# EAGLE design IRIO3 (EAGLE 9.2.2)
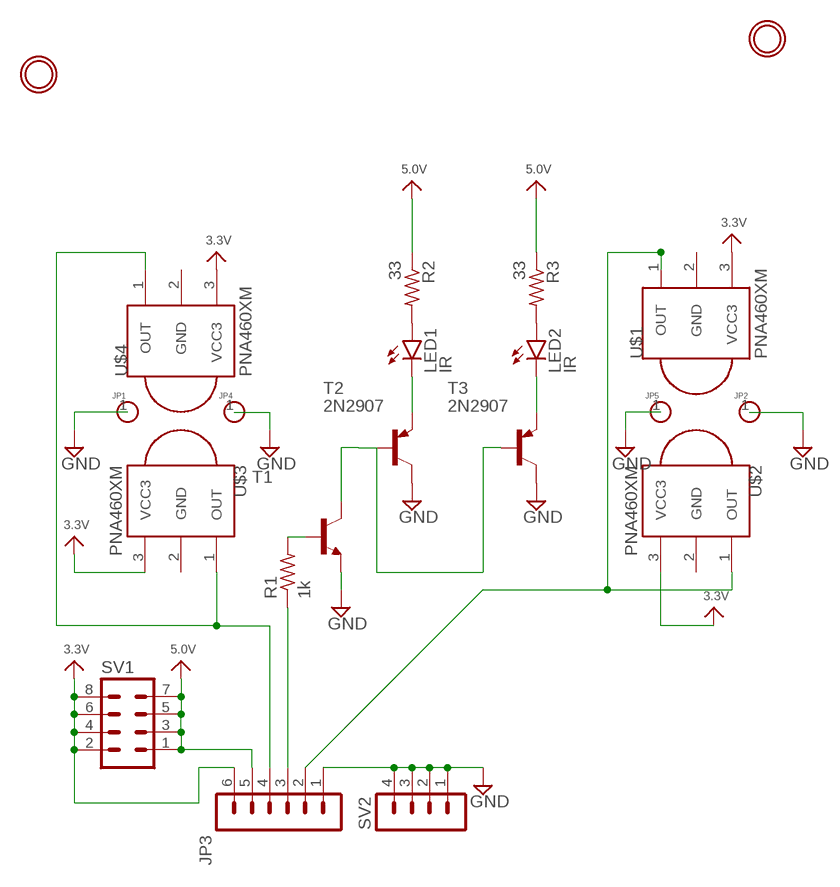
[diagram p0: schematic, sheet 1]

## Parts
JP1  HOLE-DEV  [HOLE-PAH]
JP2  HOLE-DEV  [HOLE-PAH]
JP3  MA06-1  [MA06-1]
JP4  HOLE-DEV  [HOLE-PAH]
JP5  HOLE-DEV  [HOLE-PAH]
LED1  IR  LED3MM  [LED3MM]
LED2  IR  LED3MM  [LED3MM]
R1  1k  R-US_0207/10  [0207/10]
R2  33  R-US_0204/2V  [0204V]
R3  33  R-US_0204/2V  [0204V]
SV1  MA04-2  [MA04-2]
SV2  MA04-1  [MA04-1]
T1  -NPN-TO92-EBC  [TO92-EBC]
T2  2N2907  MPSA56-TO92  [TO92-CBE]
T3  2N2907  MPSA56-TO92  [TO92-CBE]
U$1  PNA460XM  [PNA460XM]
U$2  PNA460XM  [PNA460XM]
U$3  PNA460XM  [PNA460XM]
U$4  PNA460XM  [PNA460XM]
U$7  MOUNTINGHOLE2.0  [MOUNTINGHOLE_2.0_PLATED]
U$8  MOUNTINGHOLE2.0  [MOUNTINGHOLE_2.0_PLATED]

## Nets
GND: JP1.1 JP2.1 JP3.1 JP4.1 JP5.1 SV2.1 SV2.2 SV2.3 SV2.4 T1.E T2.C T3.C
N$1: JP3.3 R1.1
N$2: JP3.4 U$3.1(OUT) U$4.1(OUT)
N$4: R1.2 T1.B
N$5: LED2.K(C) T3.E
N$6: JP3.2 U$1.1(OUT) U$2.1(OUT)
N$7: LED1.K(C) T2.E
N$8: T1.C T2.B T3.B
N$10: LED2.A R3.2
N$11: LED1.A R2.2
VCC3: JP3.6 SV1.2 SV1.4 SV1.6 SV1.8 U$1.3(VCC3) U$2.3(VCC3) U$3.3(VCC3) U$4.3(VCC3) ; supply symbol labelled 3.3V
VCC5: JP3.5 R2.1 R3.1 SV1.1 SV1.3 SV1.5 SV1.7 ; supply symbol labelled 5.0V

## Power pins joined to a net without a drawn wire
GND: U$1.2(GND) U$2.2(GND) U$3.2(GND) U$4.2(GND)

## Library data of the parts
JP1 JP2 JP4 JP5 = cyborg5:HOLE-DEV: HOLE A hole that you can solder something into.
JP3 = con-lstb:MA06-1: PIN HEADER; OC_FARNELL: unknown; OC_NEWARK: unknown
LED1 LED2 = led:LED: LED OSRAM: - CHIPLED LG R971, LG N971, LY N971, LG Q971, LY Q971, LO R971, LY R971 LH N974, LH R974 LS Q976, LO Q976, LY Q976 LO Q996 - Hyper CHIPLED LW Q18S LB Q993, LB Q99A, LB R99A - SideLED LS A670, LO A670, LY A670, LG A670, LP A670 LB A673, LV A673, LT A673, LW A673 LH A674 LY A675 LS A676, LA A676, LO A676, LY A676, LW A676 LS A679, LY A679, LG A679 - Hyper Micro SIDELED® LS Y876, LA Y876, LO Y876, LY Y876 LT Y87S - SmartLED LW L88C, LW L88S LB L89C, LB L89S, LG L890 LS L89K, LO L89K, LY L89K LS L896, LA L896, LO L896, LY L896 - TOPLED LS T670, LO T670, LY T670, LG T670, LP T670 LSG T670, LSP T670, LSY T670, LOP T670, LYG T670 LG T671, LOG T671, LSG T671 LB T673, LV T673, LT T673, LW T673 LH T674 LS T676, LA T676, LO T676, LY T676, LB T676, LH T676, LSB T676, LW T676 LB T67C, LV T67C, LT T67C, LS T67K, LO T67K, LY T67K, LW E67C LS E67B, LA E67B, LO E67B, LY E67B, LB E67C, LV E67C, LT E67C LW T67C LS T679, LY T679, LG T679 LS T770, LO T770, LY T770, LG T770, LP T770 LB T773, LV T773, LT T773, LW T773 LH T774 LS E675, LA E675, LY E675, LS T675 LS T776, LA T776, LO T776, LY T776, LB T776 LHGB T686 LT T68C, LB T68C - Hyper Mini TOPLED® LB M676 - Mini TOPLED Santana® LG M470 LS M47K, LO M47K, LY M47K Source: http://www.osram.convergy.de LUXEON: - LUMILED® LXK2-PW12-R00, LXK2-PW12-S00, LXK2-PW14-U00, LXK2-PW14-V00 LXK2-PM12-R00, LXK2-PM12-S00, LXK2-PM14-U00 LXK2-PE12-Q00, LXK2-PE12-R00, LXK2-PE12-S00, LXK2-PE14-T00, LXK2-PE14-U00 LXK2-PB12-K00, LXK2-PB12-L00, LXK2-PB12-M00, LXK2-PB14-N00, LXK2-PB14-P00, LXK2-PB14-Q00 LXK2-PR12-L00, LXK2-PR12-M00, LXK2-PR14-Q00, LXK2-PR14-R00 LXK2-PD12-Q00, LXK2-PD12-R00, LXK2-PD12-S00 LXK2-PH12-R00, LXK2-PH12-S00 LXK2-PL12-P00, LXK2-PL12-Q00, LXK2-PL12-R00 Source: www.luxeon.com KINGBRIGHT: KA-3528ASYC Source: www.kingbright.com
R1-R3 = resistor:R-US_: RESISTOR, American symbol
SV1 = con-lstb:MA04-2: PIN HEADER; OC_FARNELL: unknown; OC_NEWARK: unknown
SV2 = con-lstb:MA04-1: PIN HEADER; OC_FARNELL: unknown; OC_NEWARK: unknown
T1 = transistor:*-NPN-: NPN Transistror BF959 corrected 2008.03.06
T2 T3 = transistor-pnp:*-?: PNP Transistor
U$1-U$4 = adafruit:PNA460XM: IR 38KHz receiver PNA4602 and related receivers http://www.ladyada.net/library/pcb/eaglelibrary.html
U$7 U$8 = microbuilder:MOUNTINGHOLE: Mounting Hole For #2 screws (0.086"/2.18mm width, 0.094"/2.4mm hole) use 2.5mm

## Board
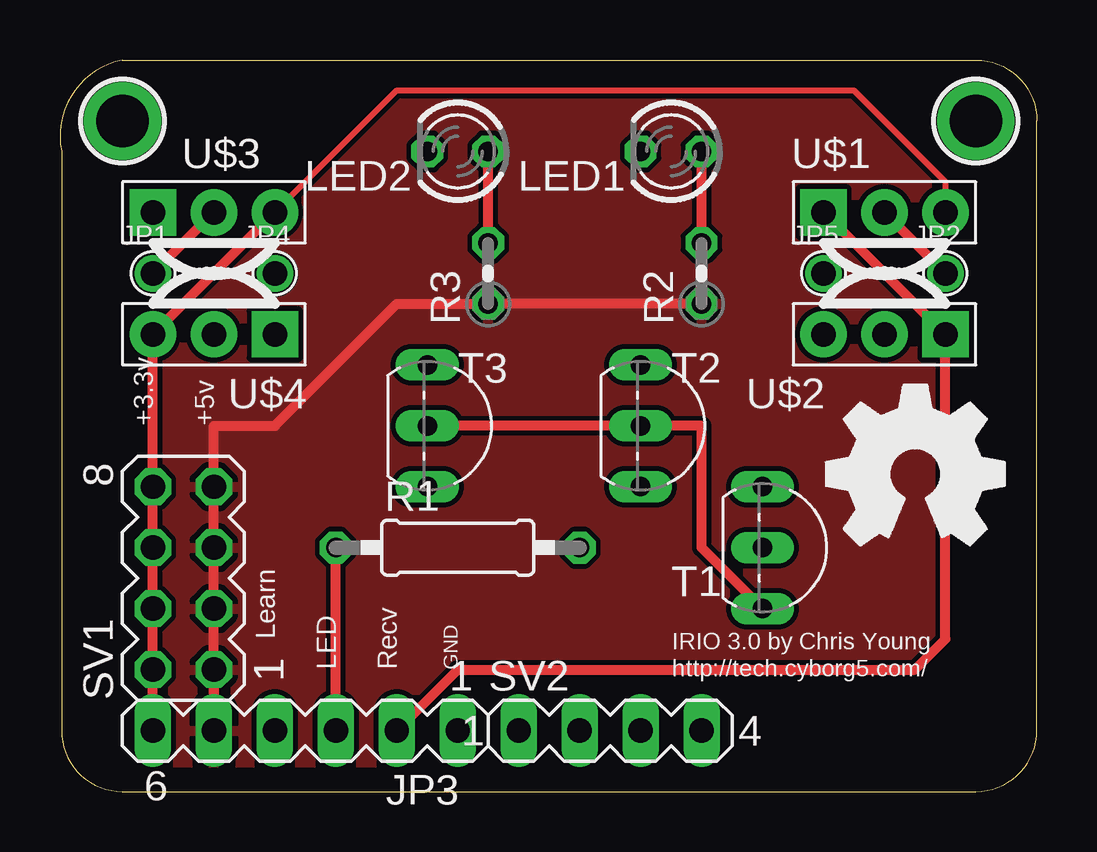
[diagram p1: board, top side]
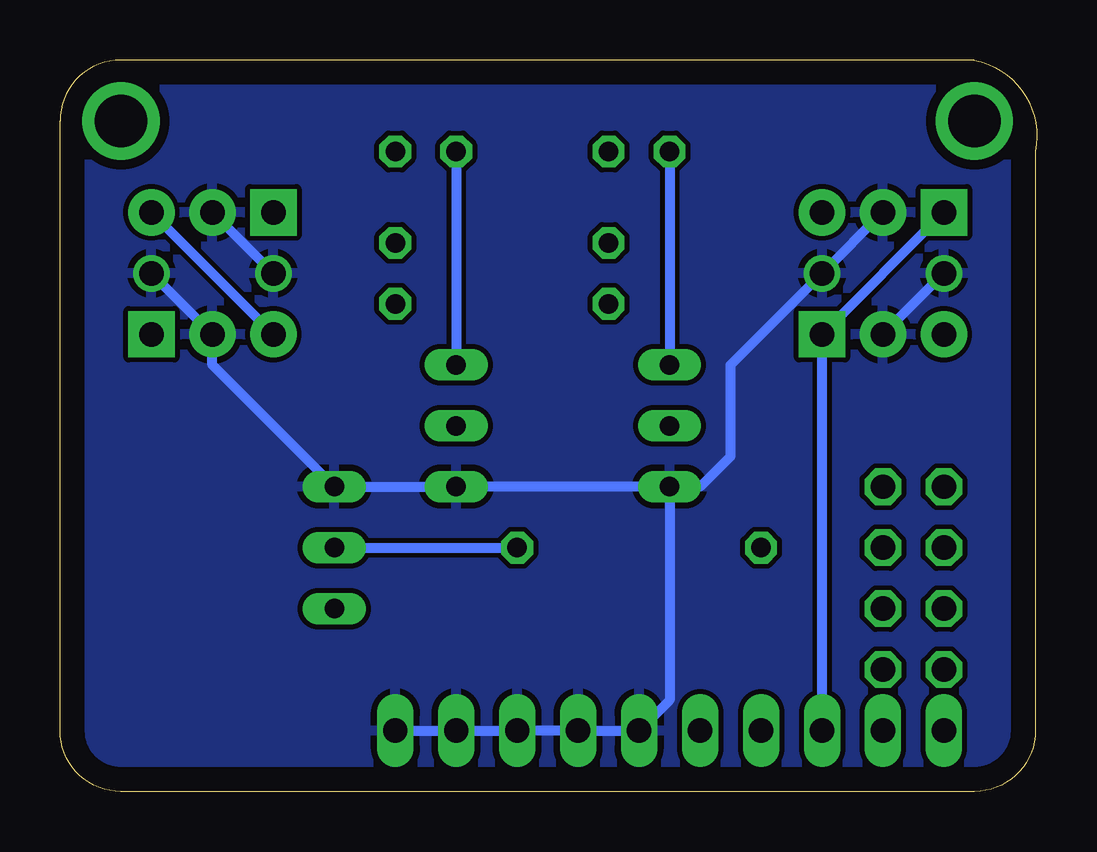
[diagram p2: board, bottom side, seen from below]

Size 40.7 x 30.48 mm. Coordinates in mm from the lower left corner, seen from the top.
Outline: 2.6,30.48 38.16,30.48 arc-90 40.7,27.94 40.7,2.54 arc-90 38.16,0 2.6,0 arc-90 0.06,2.54 0.06,26.67 arc-90 2.6,30.48
Copper layers (1*16): Top 0.035mm / dielectric 1.5mm / Bottom 0.035mm
Design rules "default *": minimum track width 10mil, minimum drill 24mil, track to track 8mil, track to pad 8mil, pad to pad 8mil, via to via 8mil, smd to smd 8mil, copper to edge 40mil, drill to drill 8mil, minimum pad ring 10mil, minimum via ring 8mil, stop-mask expansion 4mil, vias tented up to drill 0mil, thermal gap 10mil

### Footprints (pad centres in the part's own frame; a part is rotated, then mirrored left to right if it is on the bottom)
HOLE-PAH = drill 1.016: 1 0,0
MA06-1 = drill 1.016 long: 1 -6.35,0; 2 -3.81,0; 3 -1.27,0; 4 1.27,0; 5 3.81,0; 6 6.35,0
LED3MM = drill 0.813 octagon: A -1.27,0; K 1.27,0
0207/10 = drill 0.813 octagon: 1 -5.08,0; 2 5.08,0
0204V = drill 0.813 octagon: 1 -1.27,0; 2 1.27,0
MA04-2 = drill 1.016 octagon: 1 -3.81,-1.27; 2 -3.81,1.27; 3 -1.27,-1.27; 4 -1.27,1.27; 5 1.27,-1.27; 6 1.27,1.27; 7 3.81,-1.27; 8 3.81,1.27
MA04-1 = drill 1.016 long: 1 -3.81,0; 2 -1.27,0; 3 1.27,0; 4 3.81,0
TO92-EBC = drill 0.813 long: B 0,-1.27; C 2.54,-1.27; E -2.54,-1.27
TO92-CBE = drill 0.813 long: B 0,0; C 2.54,0; E -2.54,0
PNA460XM = drill 1.016 pad 1.93 square: 1 -2.54,0 | drill 1.016 pad 1.93: 2 0,0; 3 2.54,0
MOUNTINGHOLE_2.0_PLATED = drill 2.2 pad 3: P$1 0,0

### Placement (x,y rotation side)
JP1  3.87,21.59 0 top
JP2  36.89,21.59 0 top
JP3  10.22,2.54 180 top
JP4  8.95,21.59 0 top
JP5  31.81,21.59 0 top
LED1  25.46,26.67 180 top
LED2  16.57,26.67 180 top
R1  16.57,10.16 0 top
R2  26.73,21.59 90 top
R3  17.84,21.59 90 top
SV1  5.14,8.89 90 top
SV2  22.92,2.54 0 top
T1  30.54,10.16 270 top
T2  24.19,15.24 270 top
T3  15.3,15.24 270 top
U$1  34.35,24.13 0 top
U$2  34.35,19.05 180 top
U$3  6.41,24.13 0 top
U$4  6.41,19.05 180 top
U$7  38.16,27.94 0 top
U$8  2.6,27.94 0 top

### Tracks (layer width: path | path; a pad name or v marks a point on that pad's centre or on a via)
GND
  Top 0.406: U$3.2 JP1.1 | U$1.2 JP2.1
  Bottom 0.406: SV2.4 SV2.3 SV2.2 SV2.1 JP3.1 15.3,3.81 T3.C | T3.C 14.03,12.7 12.76,13.97 12.76,17.78 JP4.1 U$3.2 | JP1.1 U$4.2 | T3.C T2.C T1.E 34.35,17.78 U$2.2 JP2.1 | JP5.1 U$1.2
  pour Bottom: 2.6,0 38.16,0 arc90 40.7,2.54 40.7,27.94 arc90 38.16,30.48 3.87,30.48 arc90 0.06,26.67 0.06,2.54 arc90
N$1
  Top 0.406: JP3.3 R1.1
N$2
  Bottom 0.406: JP3.4 U$4.1 U$3.1
N$4
  Bottom 0.406: T1.B R1.2
N$5
  Bottom 0.406: LED2.K T3.E
N$6
  Top 0.406: JP3.2 16.57,5.08 35.62,5.08 36.89,6.35 U$2.1 U$1.1
N$7
  Bottom 0.406: LED1.K T2.E
N$8
  Top 0.406: T1.C 26.73,10.16 26.73,15.24 T2.B T3.B
N$10
  Top 0.406: R3.2 LED2.A
N$11
  Top 0.406: R2.2 LED1.A
VCC3
  Top 0.254: U$3.3 14.03,29.21 33.08,29.21 36.89,25.4 U$1.3
  Top 0.406: JP3.6 SV1.2 SV1.4 SV1.6 SV1.8 U$4.3 U$3.3
  Bottom 0.406: U$1.3 U$2.3
VCC5
  Top 0.406: JP3.5 SV1.1 SV1.3 SV1.5 SV1.7 6.41,15.24 8.95,15.24 14.03,20.32 R3.1 R2.1
  pour Top: 2.6,0 38.16,0 arc90 40.7,2.54 40.7,27.94 arc90 38.16,30.48 3.87,30.48 arc90 0.06,26.67 0.06,2.54 arc90

### Text on the board
tPlace: +3.3v | +5v | IRIO 3.0 by Chris Young / http://tech.cyborg5.com/ | Learn | LED | Recv | GND